# EAGLE schematic CPB_2x12_Breakout (EAGLE 9.6.2)
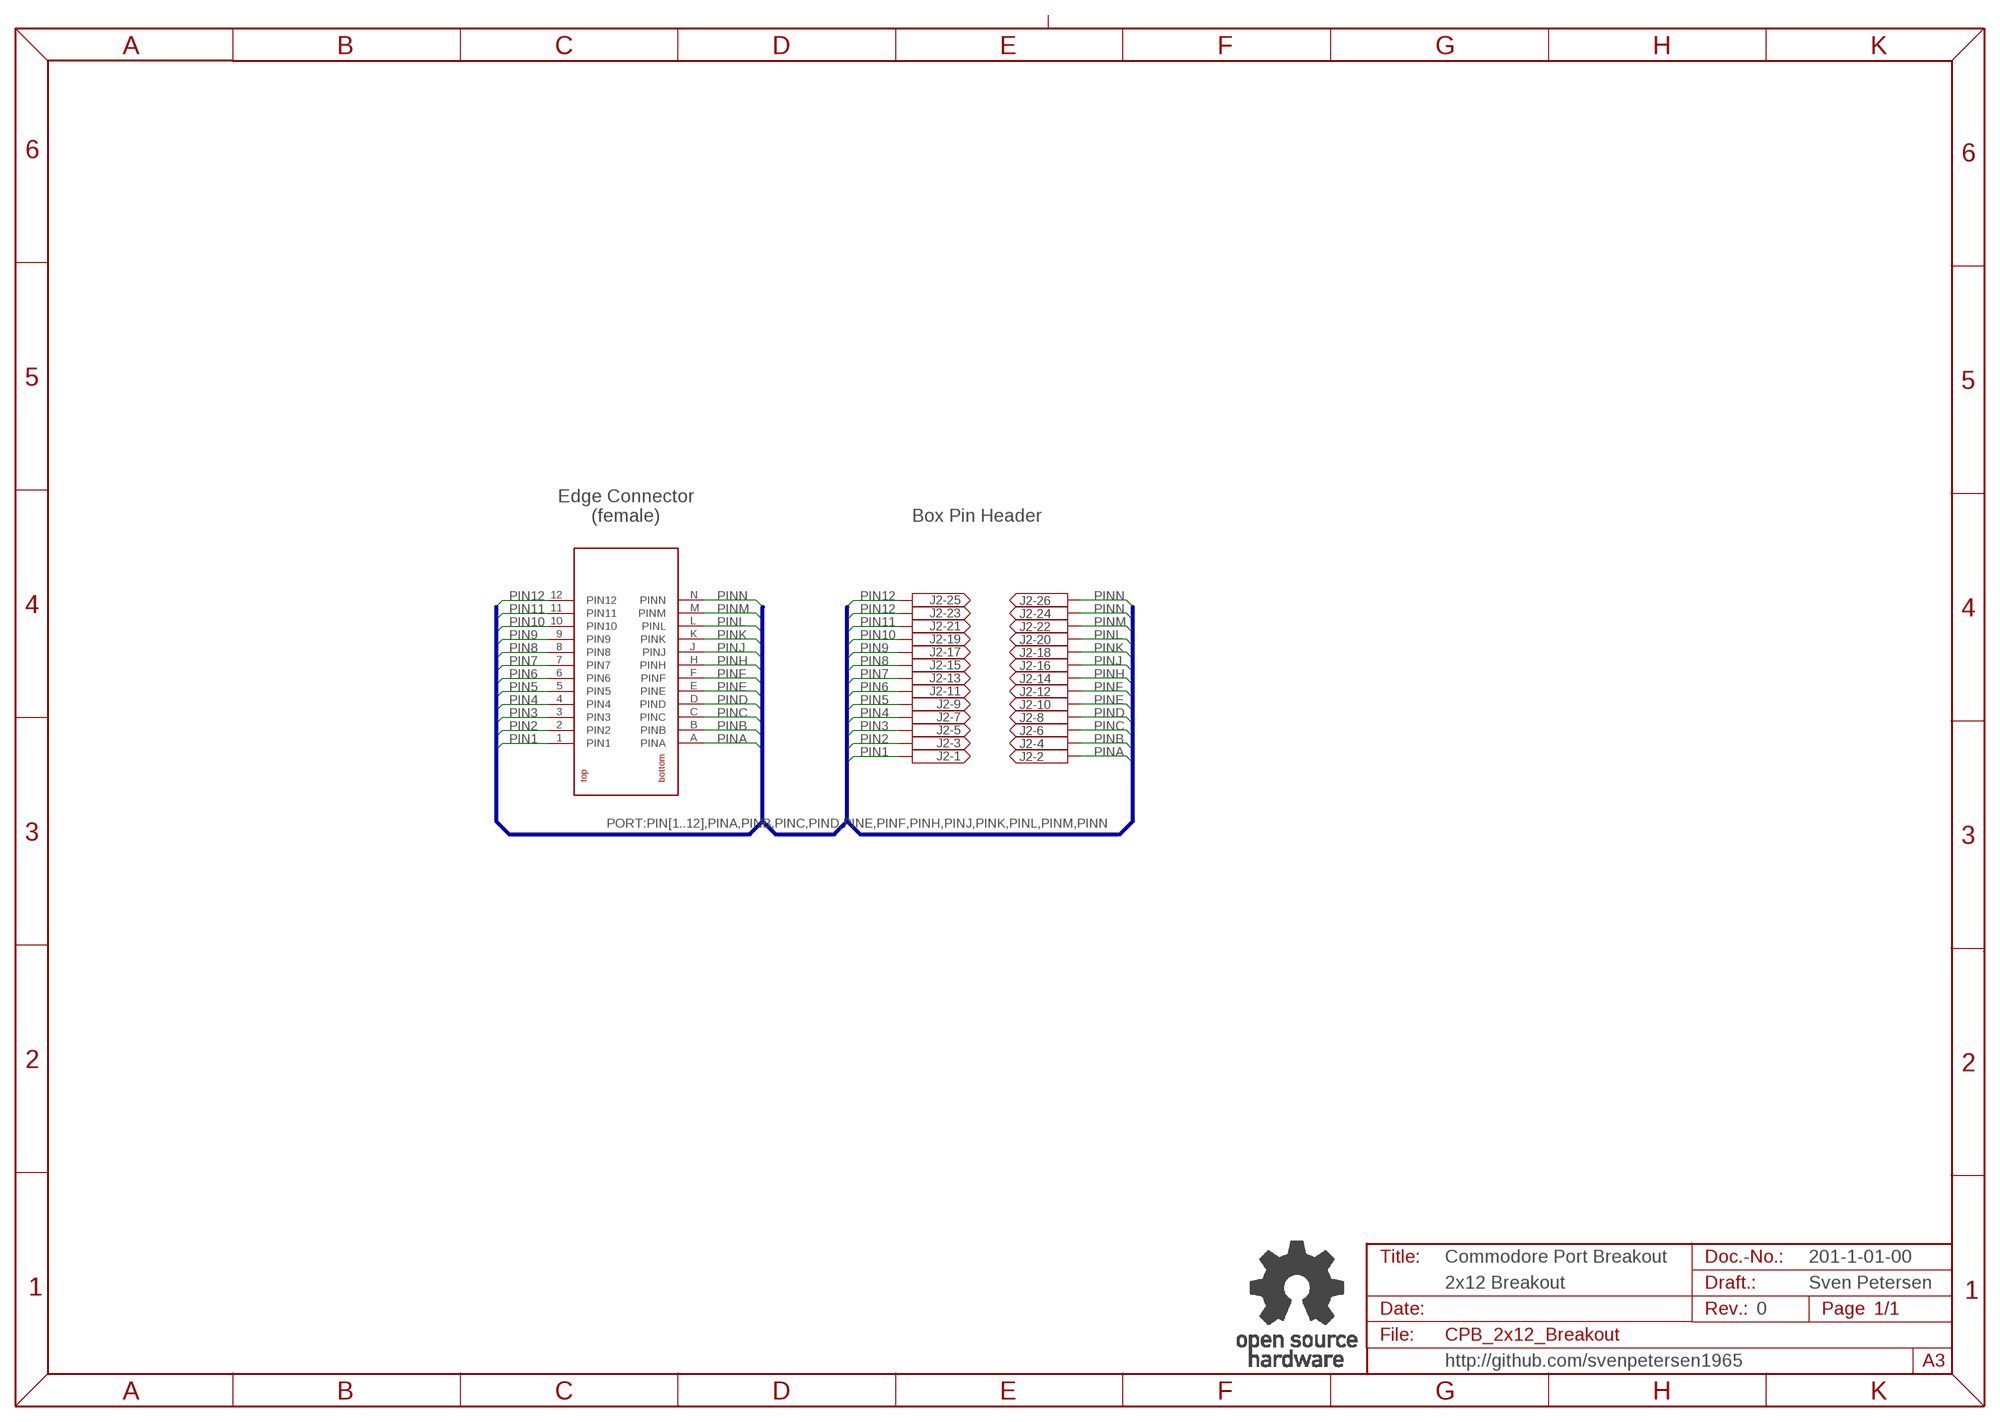
[diagram p0: schematic, sheet 1]

## Parts
J1  2X12_PORT  [2X12_PORT]
J2  2X13WANNE  [2X13WV]
U$9  OPEN_SOURCE_HW  [OPENHW]

## Nets
PIN1: J1.1(PIN1) J2.1
PIN2: J1.2(PIN2) J2.3
PIN3: J1.3(PIN3) J2.5
PIN4: J1.4(PIN4) J2.7
PIN5: J1.5(PIN5) J2.9
PIN6: J1.6(PIN6) J2.11
PIN7: J1.7(PIN7) J2.13
PIN8: J1.8(PIN8) J2.15
PIN9: J1.9(PIN9) J2.17
PIN10: J1.10(PIN10) J2.19
PIN11: J1.11(PIN11) J2.21
PIN12: J1.12(PIN12) J2.23 J2.25
PINA: J1.A(PINA) J2.2
PINB: J1.B(PINB) J2.4
PINC: J1.C(PINC) J2.6
PIND: J1.D(PIND) J2.8
PINE: J1.E(PINE) J2.10
PINF: J1.F(PINF) J2.12
PINH: J1.H(PINH) J2.14
PINJ: J1.J(PINJ) J2.16
PINK: J1.K(PINK) J2.18
PINL: J1.L(PINL) J2.20
PINM: J1.M(PINM) J2.22
PINN: J1.N(PINN) J2.24 J2.26

## Buses
PORT:PIN[1..12],PINA,PINB,PINC,PIND,PINE,PINF,PINH,PINJ,PINK,PINL,PINM,PINN

## Notes on the sheet
- Edge Connector
  (female)
- Box Pin Header
- Commodore Port Breakout | 201-1-01-00
- 2x12 Breakout | Sven Petersen
- 0
- http://github.com/svenpetersen1965

## Library data of the parts
J1 = Commodore:2X12_PORT
J2 = PINHEAD:2X13WANNE
U$9 = Logo:OPEN_SOURCE_HW